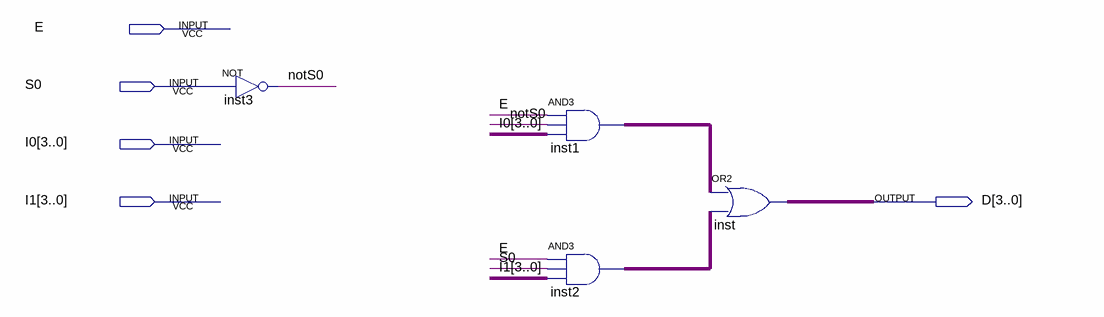
[diagram p0: schematic sheet]
// Quartus schematic mp2_1_4.bdf as structural Verilog: 4 symbols, 5 pins
module mp2_1_4 (
  input  E,
  input  S0,
  input  [3:0] I0,
  input  [3:0] I1,
  output [3:0] D
);

  wire notS0;
  wire [3:0] inst1_out, inst2_out;

  not inst3 (notS0, S0);
  assign inst1_out = {4{E}} & {4{notS0}} & I0;  // AND3 inst1, 4 bits wide
  assign inst2_out = {4{E}} & {4{S0}} & I1;  // AND3 inst2, 4 bits wide
  assign D = inst1_out | inst2_out;  // OR2 inst, 4 bits wide
endmodule
